# EAGLE schematic mod_panel_voltage (EAGLE 8.4.1)
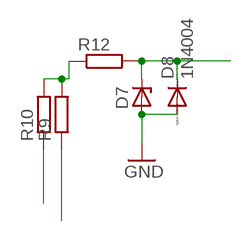
[diagram p0: schematic, sheet 1]

## Parts
D7  ZENER-DIODEDO34-7  [DO34Z7]
D8  1N4004  [DO41-10]
R9  R-EU_0204/5  [0204/5]
R10  R-EU_0204/5  [0204/5]
R12  R-EU_0204/5  [0204/5]

## Nets
GND: D7.A D8.A
N$3: R9.2 R10.2 R12.1
N$39: D7.C D8.C R12.2
N$41: R10.1
N$42: R9.1

## Library data of the parts
D7 = diode:ZENER-DIODE: Z-Diode
D8 = diode:1N4004: DIODE general purpose rectifier, 1 A
R9 R10 R12 = resistor:R-EU_: RESISTOR, European symbol